# Altium project fpc.PrjPcb
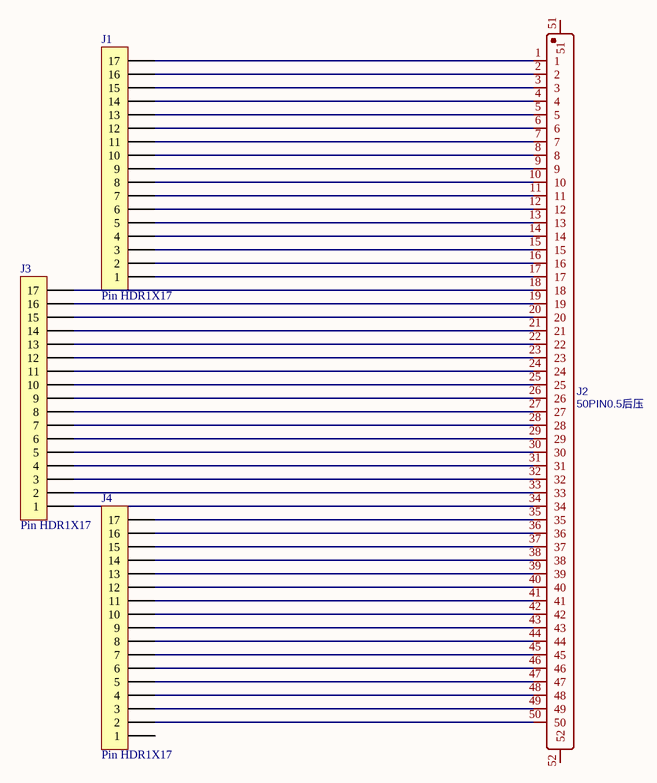
[diagram p0: fpc.SchDoc]
1 sheet, 4 parts. Net scope: global (net labels, ports and power ports of the same name join across sheets).
Board file: fpc.PcbDoc

## Sheet fpc.SchDoc
size A3; SheetNumber: 1; SheetTotal: 1

### Parts
J1  Pin HDR1X17  [Pin HDR1X17/2.54mm-S]
J2  50PIN0.5后压  [FPC-SMD_KH-FG0.5-H2.0-50PIN]
J3  Pin HDR1X17  [Pin HDR1X17/2.54mm-S]
J4  Pin HDR1X17  [Pin HDR1X17/2.54mm-S]

### Nets
NetJ1_1: J1.1 J2.17
NetJ1_2: J1.2 J2.16
NetJ1_3: J1.3 J2.15
NetJ1_4: J1.4 J2.14
NetJ1_5: J1.5 J2.13
NetJ1_6: J1.6 J2.12
NetJ1_7: J1.7 J2.11
NetJ1_8: J1.8 J2.10
NetJ1_9: J1.9 J2.9
NetJ1_10: J1.10 J2.8
NetJ1_11: J1.11 J2.7
NetJ1_12: J1.12 J2.6
NetJ1_13: J1.13 J2.5
NetJ1_14: J1.14 J2.4
NetJ1_15: J1.15 J2.3
NetJ1_16: J1.16 J2.2
NetJ1_17: J1.17 J2.1
NetJ2_18: J2.18 J3.17
NetJ2_19: J2.19 J3.16
NetJ2_20: J2.20 J3.15
NetJ2_21: J2.21 J3.14
NetJ2_22: J2.22 J3.13
NetJ2_23: J2.23 J3.12
NetJ2_24: J2.24 J3.11
NetJ2_25: J2.25 J3.10
NetJ2_26: J2.26 J3.9
NetJ2_27: J2.27 J3.8
NetJ2_28: J2.28 J3.7
NetJ2_29: J2.29 J3.6
NetJ2_30: J2.30 J3.5
NetJ2_31: J2.31 J3.4
NetJ2_32: J2.32 J3.3
NetJ2_33: J2.33 J3.2
NetJ2_34: J2.34 J3.1
NetJ2_35: J2.35 J4.17
NetJ2_36: J2.36 J4.16
NetJ2_37: J2.37 J4.15
NetJ2_38: J2.38 J4.14
NetJ2_39: J2.39 J4.13
NetJ2_40: J2.40 J4.12
NetJ2_41: J2.41 J4.11
NetJ2_42: J2.42 J4.10
NetJ2_43: J2.43 J4.9
NetJ2_44: J2.44 J4.8
NetJ2_45: J2.45 J4.7
NetJ2_46: J2.46 J4.6
NetJ2_47: J2.47 J4.5
NetJ2_48: J2.48 J4.4
NetJ2_49: J2.49 J4.3
NetJ2_50: J2.50 J4.2

Not connected (* = marked no-connect by the designer): J2 51 52; J4 1

### Library data of the parts
J2 = 50PIN0.5后压: BOM_Manufacturer: null; Contributor: LCSC; BOM_Supplier: LCSC; BOM_Supplier Part: C9900011403; BOM_Manufacturer Part: 50PIN0.5后压; BOM_JLCPCB Part Class: Extended Part; spicePre: C; spiceSymbolName: 50PIN0.5后压